# EAGLE design display adapter (EAGLE 9.0.1)
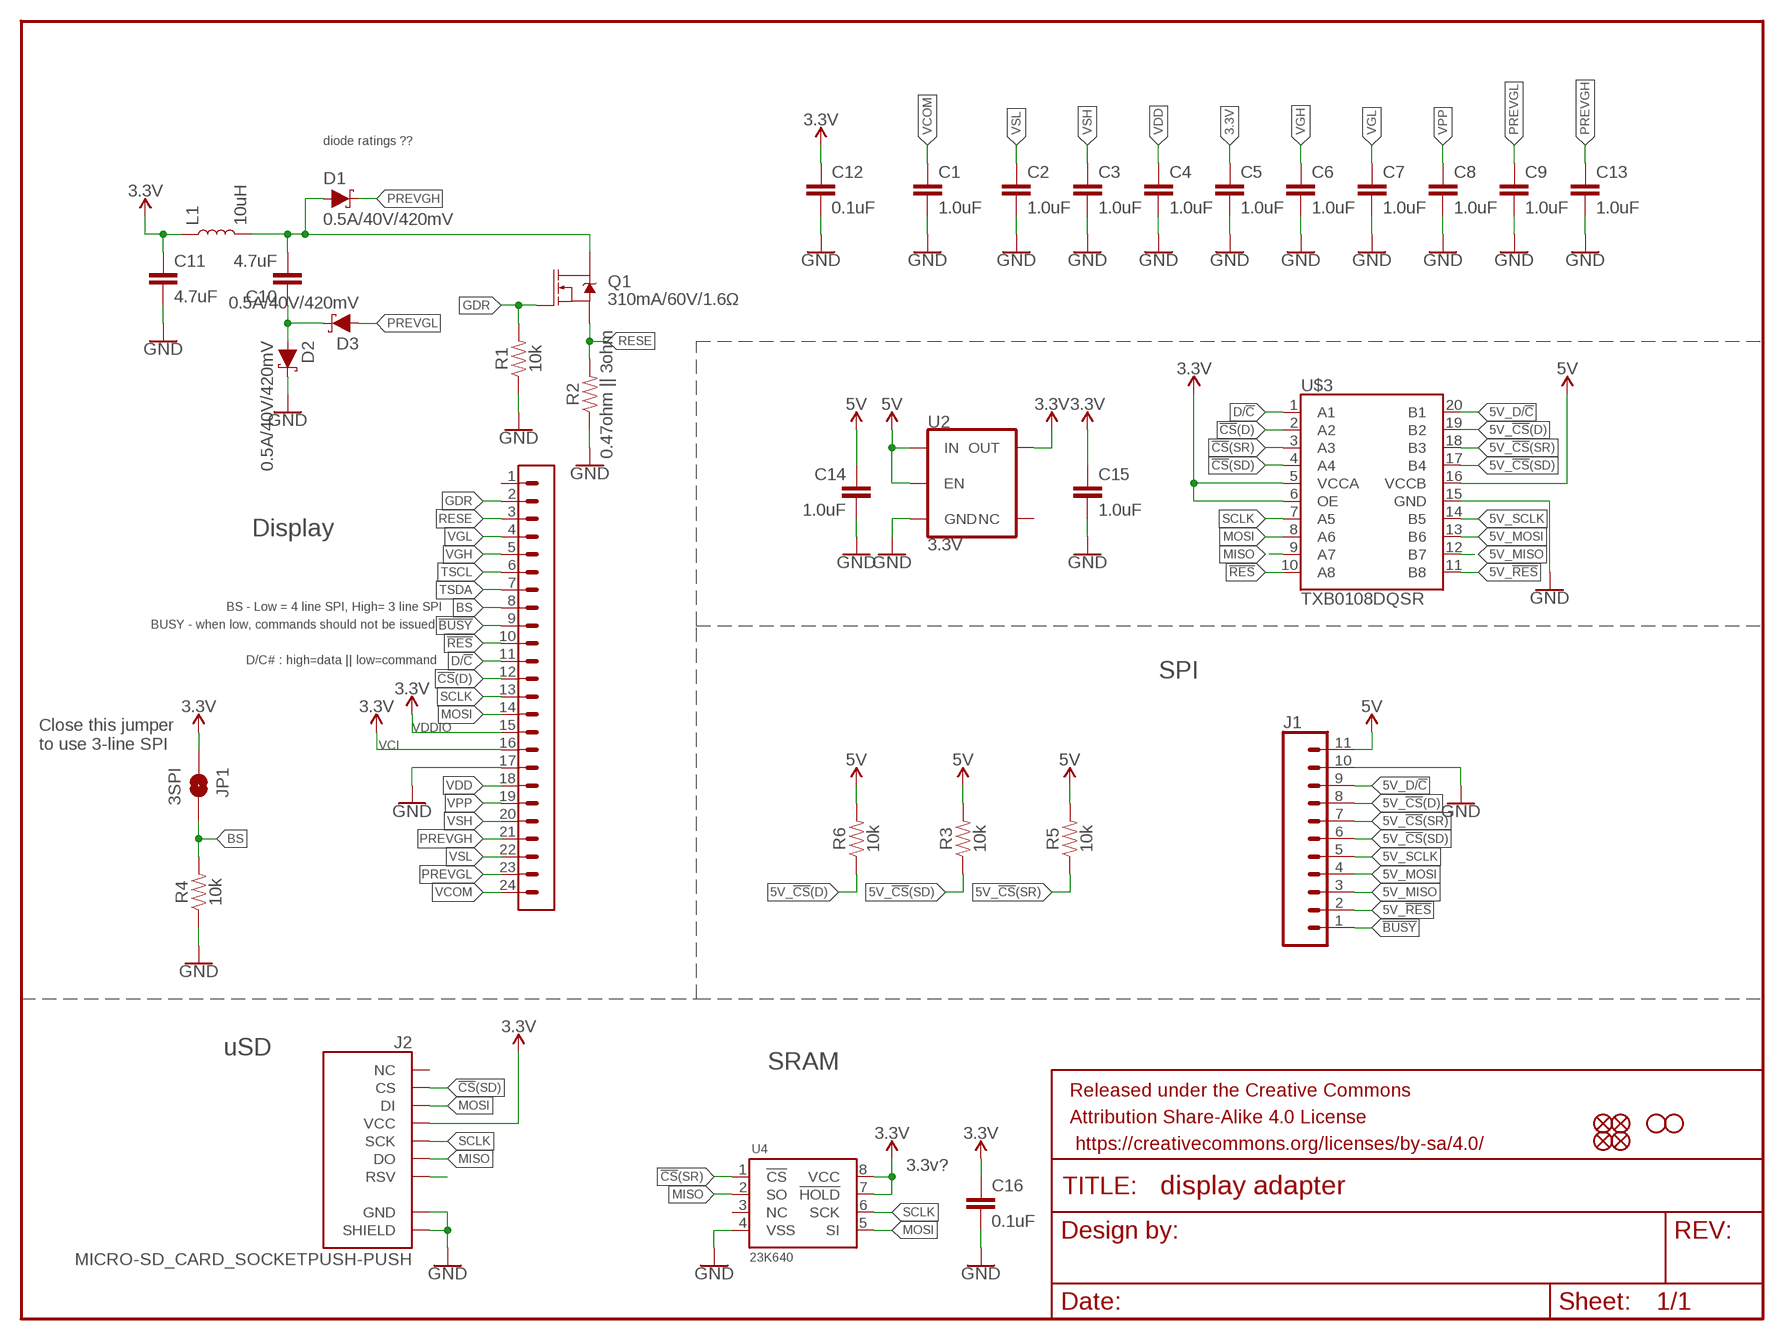
[diagram p0: schematic, sheet 1]

## Parts
C1  1.0uF  1.0UF-0603-16V-10%  [0603]
C2  1.0uF  1.0UF-0805-25V-10%  [0805]
C3  1.0uF  1.0UF-0805-25V-10%  [0805]
C4  1.0uF  1.0UF-0805-25V-10%  [0805]
C5  1.0uF  1.0UF-0805-25V-10%  [0805]
C6  1.0uF  1.0UF-0805-25V-10%  [0805]
C7  1.0uF  1.0UF-0805-25V-10%  [0805]
C8  1.0uF  1.0UF-0805-25V-10%  [0805]
C9  1.0uF  1.0UF-0805-25V-10%  [0805]
C10  4.7uF  22UF-0805-6.3V-20%  [0805]
C11  4.7uF  22UF-0805-6.3V-20%  [0805]
C12  0.1uF  0.1UF-0603-25V-(+80/-20%)  [0603]
C13  1.0uF  1.0UF-0805-25V-10%  [0805]
C14  1.0uF  1.0UF-0603-16V-10%  [0603]
C15  1.0uF  1.0UF-0603-16V-10%  [0603]
C16  0.1uF  0.1UF-0603-25V-(+80/-20%)  [0603]
D1  0.5A/40V/420mV  DIODE-SCHOTTKY-PMEG4005EJ  [SOD-323]
D2  0.5A/40V/420mV  DIODE-SCHOTTKY-PMEG4005EJ  [SOD-323]
D3  0.5A/40V/420mV  DIODE-SCHOTTKY-PMEG4005EJ  [SOD-323]
FD1  FIDUCIALUFIDUCIAL  [FIDUCIAL-MICRO]
FD2  FIDUCIALUFIDUCIAL  [FIDUCIAL-MICRO]
FD3  FIDUCIALUFIDUCIAL  [FIDUCIAL-MICRO]
FD4  FIDUCIALUFIDUCIAL  [FIDUCIAL-MICRO]
FRAME1  FRAME-LETTER  [CREATIVE_COMMONS]
H1  STAND-OFF  [STAND-OFF]
H2  STAND-OFF  [STAND-OFF]
J1  CONN_111X11_NO_SILK  [1X11_NO_SILK]
J2  MICRO-SD_CARD_SOCKETPUSH-PUSH  [MICRO-SD-SOCKET]
JP1  3SPI  JUMPER-SMT_2_NO_SILK  [SMT-JUMPER_2_NO_SILK]
L1  10uH  INDUCTOR-CDRH-10UH  [INDUCTOR_4.7UH]
Q1  310mA/60V/1.6Ω  MOSFET-NCH-2N7002PW  [SOT323]
R1  10k  10KOHM-0603-1/10W-1%  [0603]
R2  0.47ohm || 3ohm  RESISTOR0603  [0603]
R3  10k  10KOHM-0603-1/10W-1%  [0603]
R4  10k  10KOHM-0603-1/10W-1%  [0603]
R5  10k  10KOHM-0603-1/10W-1%  [0603]
R6  10k  10KOHM-0603-1/10W-1%  [0603]
U2  3.3V  V_REG_AP2112K-3.3V  [SOT23-5]
U4  23K640  [SO08]
U$1  24_PIN_FPC_0.5MM  [24_PIN_FPC_0.5MM]
U$3  TXB0108DQSR  TXB0108  [UFDFN-20]

## Nets
3.3V: C5.1 C11.1 C12.1 C15.1 C16.1 J2.VCC JP1.1 L1.P$1 U2.5(OUT) U4.7(!HOLD) U4.8(VCC) U$1.15 U$1.16 U$3.5(VCCA) U$3.6(OE)
5V: C14.1 J1.11 R3.2 R5.2 R6.2 U2.1(IN) U2.3(EN) U$3.16(VCCB)
5V_!CS!(D): J1.8 R6.1 U$3.19(B2)
5V_!CS!(SD): J1.6 R3.1 U$3.17(B4)
5V_!CS!(SR): J1.7 R5.1 U$3.18(B3)
5V_!RES: J1.2 U$3.11(B8)
5V_D/!C: J1.9 U$3.20(B1)
5V_MISO: J1.3 U$3.12(B7)
5V_MOSI: J1.4 U$3.13(B6)
5V_SCLK: J1.5 U$3.14(B5)
!BUSY: J1.1 U$1.9
!CS!(D): U$1.12 U$3.2(A2)
!CS!(SD): J2.CS U$3.4(A4)
!CS!(SR): U4.1(!CS) U$3.3(A3)
!RES: U$1.10 U$3.10(A8)
BS: JP1.2 R4.2 U$1.8
D/!C: U$1.11 U$3.1(A1)
GDR: Q1.1(G) R1.2 U$1.2
GND: C1.2 C2.2 C3.2 C4.2 C5.2 C6.2 C7.2 C8.2 C9.2 C11.2 C12.2 C13.2 C14.2 C15.2 C16.2 D2.C J1.10 J2.CD1(SHIELD) J2.GND R1.1 R2.1 R4.1 U2.2(GND) U4.4(VSS) U$1.17 U$3.15(GND)
MISO: J2.DO U4.2(SO) U$3.9(A7)
MOSI: J2.DI U4.5(SI) U$1.14 U$3.8(A6)
N$2: C10.1 D2.A D3.C
N$5: C10.2 D1.A L1.P$2 Q1.3(D)
N$11: J2.RSV1(RSV)
PREVGH: C13.1 D1.C U$1.21
PREVGL: C9.1 D3.A U$1.23
RESE: Q1.2(S) R2.2 U$1.3
SCLK: J2.SCLK(SCK) U4.6(SCK) U$1.13 U$3.7(A5)
TSCL: U$1.6
TSDA: U$1.7
VCOM: C1.1 U$1.24
VDD: C4.1 U$1.18
VGH: C6.1 U$1.5
VGL: C7.1 U$1.4
VPP: C8.1 U$1.19
VSH: C3.1 U$1.20
VSL: C2.1 U$1.22
Unconnected: J2.RSV2(NC) U2.4(NC) U4.3(NC) U$1.1

## Notes on the sheet
- diode ratings ??
- Display
- BS - Low = 4 line SPI, High= 3 line SPI
- BUSY - when low, commands should not be issued
- D/C# : high=data || low=command
- SPI
- VDDIO
- Close this jumper
  to use 3-line SPI
- VCI
- uSD
- SRAM
- 3.3v?

## Library data of the parts
C1 C14 C15 = SparkFun-Capacitors:1.0UF: 1µF ceramic capacitors A capacitor is a passive two-terminal electrical component used to store electrical energy temporarily in an electric field.; PROD_ID: CAP-00868
C2-C9 C13 = SparkFun-Capacitors:1.0UF: 1µF ceramic capacitors A capacitor is a passive two-terminal electrical component used to store electrical energy temporarily in an electric field.; PROD_ID: CAP-08064
C10 C11 = SparkFun-Capacitors:22UF: 22µF ceramic capacitors A capacitor is a passive two-terminal electrical component used to store electrical energy temporarily in an electric field.; PROD_ID: CAP-08402; VALUE: 22uF
C12 C16 = SparkFun-Capacitors:0.1UF: 0.1µF ceramic capacitors A capacitor is a passive two-terminal electrical component used to store electrical energy temporarily in an electric field.; PROD_ID: CAP-00810
D1-D3 = SparkFun-DiscreteSemi:DIODE-SCHOTTKY: Schottky diode A Schottky diode is a semiconductor diode which has a low forward voltage drop and a very fast switching action.; PROD_ID: DIO-10955
FD1-FD4 = SparkFun-Aesthetics:FIDUCIAL: Fiducial Alignment Points Point-of-reference for pick-and-place machines and other optical instruments.
FRAME1 = SparkFun-Aesthetics:FRAME-LETTER: Schematic Frame - Letter Standard 8.5x11 US Letter frame
H1 H2 = SparkFun-Hardware:STAND-OFF: Stand Off Drill holes for mechanically mounting via screws, standoffs, etc. Note: Use the keepout ring to avoid running the screw head into surrounding components. Variant Overviews STAND-OFF - Mechanical footprint for a #4 phillips button head screw. STAND-OFF-TIGHT - Mechanical footprint for a #4 phillips button head screw, Example SparkFun Products Screw - Phillips Head (1/4", 4-40, 10 pack) <https://www.sparkfun.com/products/10453> (PRT-10453) Screw - Phillips Head (1/2", 4-40, 10 pack) <https://www.sparkfun.com/products/10452> (PRT-10452) Screw - Phillips Head (3/4", 4-40, 10 pack) <https://www.sparkfun.com/products/10451> (PRT-10451) Screw - Phillips Head (1", 4-40, 10 pack) <https://www.sparkfun.com/products/10450> (PRT-10450)
J1 = SparkFun-Connectors:CONN_11: Multi connection point. Often used as Generic Header-pin footprint for 0.1 inch spaced/style header connections On any of the 0.1 inch spaced packages, you can populate with these: Break Away Headers - Straight <https://www.sparkfun.com/products/116> (PRT-00116) Break Away Male Headers - Right Angle <https://www.sparkfun.com/products/553> (PRT-00553) Female Headers <https://www.sparkfun.com/products/115> (PRT-00115) Break Away Headers - Machine Pin <https://www.sparkfun.com/products/117> (PRT-00117) Break Away Female Headers - Swiss Machine Pin <https://www.sparkfun.com/products/743> (PRT-00743) For SCREWTERMINALS and SPRING TERMINALS visit here: Screw Terimnals on SparkFun.com <https://www.sparkfun.com/search/results?term=Screw+Terminals> (5mm/3.5mm/2.54mm spacing) This device is also useful as a general connection point to wire up your design to another part of your project. Our various solder wires solder well into these plated through hole pads. Hook-Up Wire - Assortment (Stranded, 22 AWG) <https://www.sparkfun.com/products/11375> (PRT-11375) Hook-Up Wire - Assortment (Solid Core, 22 AWG) <https://www.sparkfun.com/products/11367> (PRT-11367) View the entire wire category on our website here <https://www.sparkfun.com/categories/141>
J2 = SparkFun-Connectors:MICRO-SD_CARD_SOCKET: microSD Socket for Transflash Push-push type µSD socket. tDoc lines correctly indicate media card edge positions when inserting (unlocked, locked, depressed). NOTE: CD1 and CD2 are connected internally, and the default detect state of the socket is detect pin to ground. SparkFun Products: WAV Trigger <https://www.sparkfun.com/products/13660> CAN-Bus Shield <https://www.sparkfun.com/products/13262> SparkFun Level Shifing microSD Breakout <https://www.sparkfun.com/products/13743>; PROD_ID: CONN-07820
JP1 = SparkFun-Jumpers:JUMPER-SMT_2_NO: Normally open jumper This jumper has two pads in close proximity to each other. Apply solder to close the connection. Round pads are easier to solder for beginners, but are a lot larger. SparkFun Product that uses the round pads: SparkFun EL Sequencer <https://www.sparkfun.com/products/12781>
L1 = SparkFun-Coils:INDUCTOR: Inductors Resist changes in electrical current. Basically a coil of wire. SparkFun Products: SparkFun Load Cell Amplifier - HX711 <https://www.sparkfun.com/products/13879> IOIO-OTG - V2.2 <https://www.sparkfun.com/products/13613>; PROD_ID: NDUC-13968
Q1 = SparkFun-DiscreteSemi:MOSFET-NCH: N-channel MOSFETs Voltage controlled devices that allow control of high current outputs. SparkFun Products: SparkFun OpenScale <https://www.sparkfun.com/products/13261> SparkFun Digital Sandbox <https://www.sparkfun.com/products/12651> SparkFun Monster Moto Shield <https://www.sparkfun.com/products/10182> SparkFun MOSFET Power Controller <https://www.sparkfun.com/products/11214>; PROD_ID: TRANS-11151
R1 R3-R6 = SparkFun-Resistors:10KOHM: 10kΩ resistor A resistor is a passive two-terminal electrical component that implements electrical resistance as a circuit element. Resistors act to reduce current flow, and, at the same time, act to lower voltage levels within circuits. - Wikipedia; PROD_ID: RES-00824
R2 = SparkFun-Resistors:RESISTOR: Generic Resistor Package
U2 = SparkFun-IC-Power:V_REG_AP2112: AP2112 - 600mA CMOS LDO Regulator w/ Enable The AP2112 is CMOS process low dropout linear regulator with enable function, the regulator delivers a guaranteed 600mA (min.) continuous load current. Features Output Voltage Accuracy: ±1.5% Output Current: 600mA (Min.) Foldback Short Current Protection: 50mA Enable Function to Turn ON/OFF VOUT Low Dropout Voltage (3.3V): 250mV (Typ.) @IOUT=600mA Excellent Load Regulation: 0.2%/A (Typ.) Excellent Line Regulation: 0.02%/V (Typ.) Low Quiescent Current: 55μA (Typ.) Low Standby Current: 0.01μA (Typ.) Low Output Noise: 50μVRMS PSRR: 100Hz -65dB, 1kHz -65dB OTSD Protection Stable with 1.0μF Flexible Cap: Ceramic, Tantalum and Aluminum Electrolytic Operation Temperature Range: -40°C to 85°C ESD: MM 400V, HBM 4000V; PROD_ID: VREG-12457
U4 = SparkFun-IC-Memory:23K640
U$1 = ePaper:24_PIN_FPC_0.5MM
U$3 = SparkFun-IC-Comms:TXB0108: 8-Bit Bi-Directional Level Shifter 1.2V-3.6V (VCCA) to 1.65V-5.5V (VCCB) bi-directional level shifter with auto direction sensing. Max data rate - VCCA 1.2V: 20Mbps (50ns), VCCA 3.3V: 100Mbps (10ns) Digikey: 296-27217-1-ND (20-UFDFN) SparkFun Products SparkFun GPS Logger Shield <https://www.sparkfun.com/products/13750> (GPS-13750) SparkFun Block for Intel® Edison - microSD <https://www.sparkfun.com/products/13041> (DEV-13041) SparkFun Block for Intel® Edison - Dual H-Bridge <https://www.sparkfun.com/products/13043> (DEV-13043) SparkFun Block for Intel® Edison - GPIO <https://www.sparkfun.com/products/13038> (DEV-13038) SparkFun Block for Intel® Edison - Raspberry Pi B <https://www.sparkfun.com/products/13044> (DEV-13044); PROD_ID: IC-12292

## Board
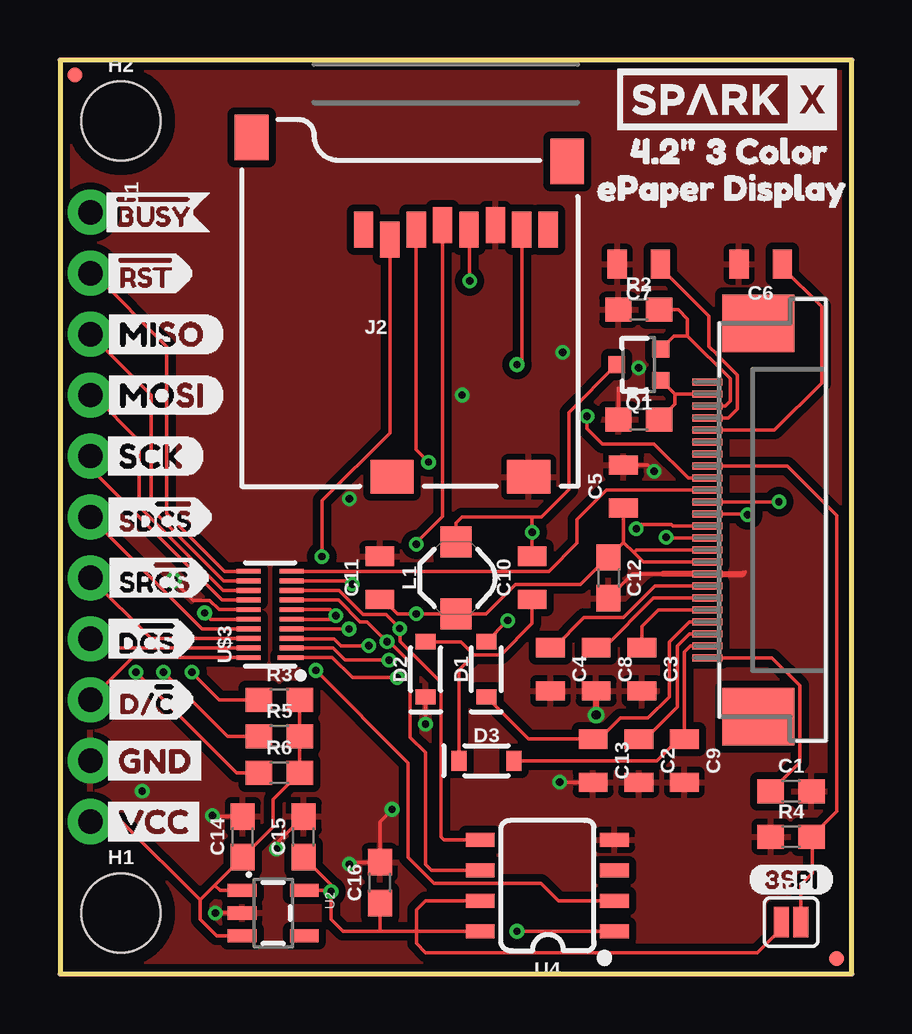
[diagram p1: board, top side]
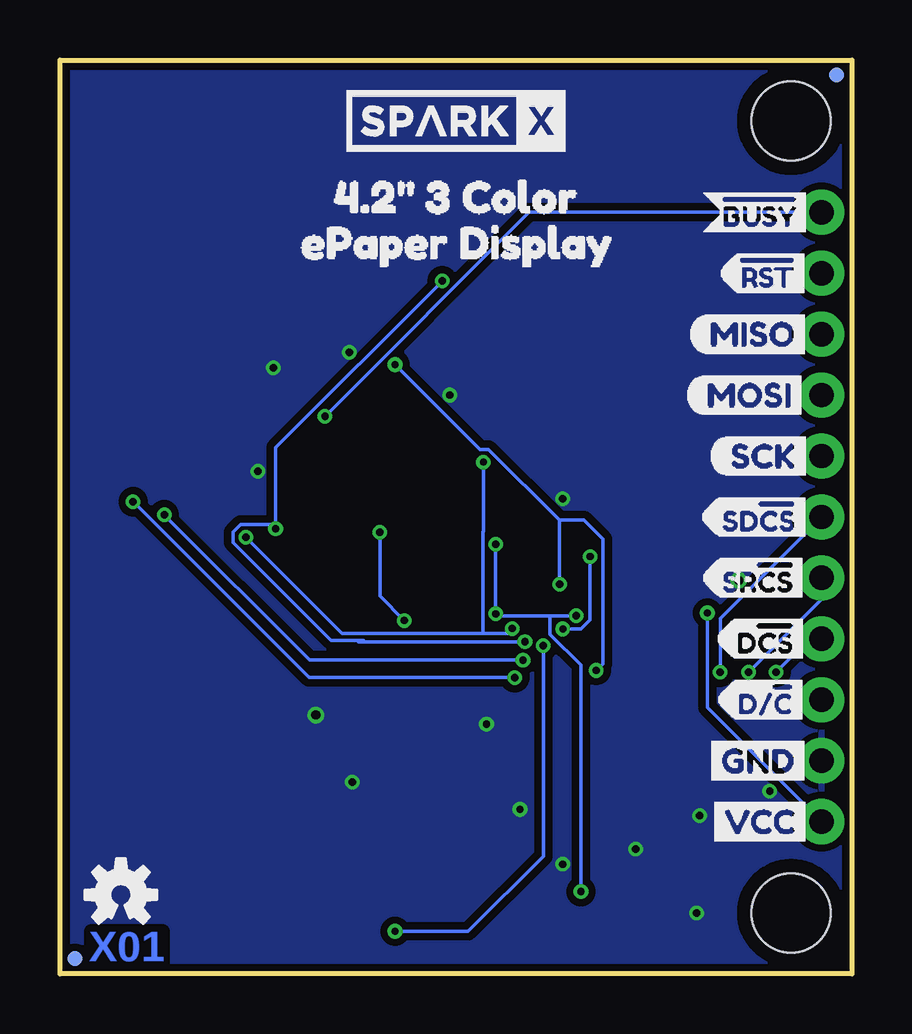
[diagram p2: board, bottom side, seen from below]

Size 33.02 x 38.1 mm. Coordinates in mm from the lower left corner, seen from the top.
Outline: 0,0 33.02,0 33.02,38.1 0,38.1 0,0
Copper layers (1*16): Top 0.035mm / dielectric 1.5mm / Bottom 0.035mm
Design rules "SparkFun-2-layer-PCBWay-LIMIT": minimum track width 6mil, minimum drill 0.3mm, track to track 6mil, track to pad 6mil, pad to pad 6mil, via to via 6mil, smd to smd 6mil, copper to edge 6mil, drill to drill 6mil, minimum pad ring 6mil, minimum via ring 6mil, stop-mask expansion 4mil, vias tented up to drill 25mil, thermal gap 10mil

### Footprints (pad centres in the part's own frame; a part is rotated, then mirrored left to right if it is on the bottom)
0603 = smd 1.1 x 1: 1 -0.85,0; 2 0.85,0
0805 = smd 0.8 x 1.2: 1 -0.9,0; 2 0.9,0
SOD-323 = smd 0.63 x 0.83: A 1.15,0; C -1.15,0
FIDUCIAL-MICRO = smd 0.635 x 0.635: 1 0,0
STAND-OFF = hole 3.302: 0,0
1X11_NO_SILK = drill 1.016 pad 1.88: 1 0,0; 2 2.54,0; 3 5.08,0; 4 7.62,0; 5 10.16,0; 6 12.7,0; 7 15.24,0; 8 17.78,0; 9 20.32,0; 10 22.86,0; 11 25.4,0
MICRO-SD-SOCKET = smd 1.8 x 1.4: CD1 -2.05,0.4; CD2 -7.75,0.4 | smd 0.8 x 1.5: CS -7.84,10.3; DI -6.74,10.7; DO -2.34,10.7; GND -3.44,10.9; RSV1 -8.94,10.7; RSV2 -1.24,10.7; SCLK -4.54,10.7; VCC -5.64,10.9 | smd 1.4 x 1.9: GND1 -13.6,14.55; GND3 -0.45,13.55
SMT-JUMPER_2_NO_SILK = smd 0.635 x 1.27: 1 -0.406,0; 2 0.406,0
INDUCTOR_4.7UH = smd 1.3 x 1.3: P$1 -1.5,0; P$2 1.5,0
SOT323 = smd 0.7 x 0.7: 1 -0.65,-0.925; 2 0.65,-0.925; 3 0,0.925
SOT23-5 = smd 0.55 x 1.2: 1 -0.95,-1.3; 2 0,-1.3; 3 0.95,-1.3; 4 0.95,1.3; 5 -0.95,1.3
SO08 = smd 0.6 x 1.2: 1 -1.905,-2.8; 2 -0.635,-2.8; 3 0.635,-2.8; 4 1.905,-2.8; 5 1.905,2.8; 6 0.635,2.8; 7 -0.635,2.8; 8 -1.905,2.8
24_PIN_FPC_0.5MM = smd 0.3 x 1.25: 1 5.75,2.225; 2 5.25,2.225; 3 4.75,2.225; 4 4.25,2.225; 5 3.75,2.225; 6 3.25,2.225; 7 2.75,2.225; 8 2.25,2.225; 9 1.75,2.225; 10 1.25,2.225; 11 0.75,2.225; 12 0.25,2.225; 13 -0.25,2.225; 14 -0.75,2.225; 15 -1.25,2.225; 16 -1.75,2.225; 17 -2.25,2.225; 18 -2.75,2.225; 19 -3.25,2.225; 20 -3.75,2.225; 21 -4.25,2.225; 22 -4.75,2.225; 23 -5.25,2.225; 24 -5.75,2.225 | smd 2.4 x 3: NC1 8.2,0.1; NC2 -8.2,0.1
UFDFN-20 = smd 0.2 x 1.1: 1 -1.8,-0.85 | smd 0.2 x 1: 2 -1.4,-0.9; 3 -1,-0.9; 4 -0.6,-0.9; 5 -0.2,-0.9; 6 0.2,-0.9; 7 0.6,-0.9; 8 1,-0.9; 9 1.4,-0.9; 10 1.8,-0.9; 11 1.8,0.9; 12 1.4,0.9; 13 1,0.9; 14 0.6,0.9; 15 0.2,0.9; 16 -0.2,0.9; 17 -0.6,0.9; 18 -1,0.9; 19 -1.4,0.9; 20 -1.8,0.9

### Placement (x,y rotation side)
C1  30.48,7.62 0 top
C2  24.13,8.89 270 top
C3  24.26,12.7 270 top
C4  20.45,12.7 270 top
C5  23.5,20.32 90 top
C6  29.21,29.59 180 top
C7  24.13,29.59 180 top
C8  22.35,12.7 270 top
C9  26.04,8.89 270 top
C10  19.68,16.51 90 top
C11  13.34,16.51 90 top
C12  22.86,16.51 270 top
C13  22.23,8.89 270 top
C14  7.62,5.71 90 top
C15  10.16,5.71 90 top
C16  13.34,3.81 90 top
D1  17.78,12.7 90 top
D2  15.24,12.7 90 top
D3  17.78,8.89 0 top
FD1  0.64,37.47 0 bottom
FD2  32.38,0.64 0 bottom
FD3  32.38,0.64 0 top
FD4  0.64,37.47 0 top
FRAME1  2.54,-10.16 0 top  (outside the outline)
H1  2.54,2.54 0 top
H2  2.54,35.56 0 top
J1  1.27,31.75 270 top
J2  21.59,20.32 0 top
JP1  30.48,2.16 0 top
L1  16.51,16.51 90 top
Q1  24.13,25.4 90 top
R1  24.13,23.11 0 top
R2  24.13,27.69 0 top
R3  9.14,11.43 0 top
R4  30.48,5.71 0 top
R5  9.14,9.91 0 top
R6  9.14,8.38 0 top
U2  8.89,2.54 270 top
U4  20.32,3.68 90 top
U$1  29.21,18.92 90 top
U$2  [OSHW-LOGO-S]  30.48,3.3 0 bottom
U$3  8.76,14.99 90 top
U$4  [#BUSY0]  1.27,31.75 0 top
U$5  SPARKX-LOGO4  [SPARKX-MEDIUM]  27.81,36.45 0 top
U$6  [#BUSY1]  6.48,31.75 0 bottom
U$7  [D##C10]  1.4,11.43 0 top
U$8  [MISO1]  1.52,26.67 0 top
U$9  [D#CS2]  1.4,13.97 0 top
U$10  [SD#CS0]  1.4,19.05 0 top
U$11  [#RST1]  1.4,29.21 0 top
U$12  [3SPI0]  28.7,3.94 0 top
U$13  [VCC9]  1.52,6.35 0 top
U$14  [GND9]  1.52,8.89 0 top
U$15  [SR#CS1]  1.4,16.51 0 top
U$16  [MOSI0]  1.52,24.13 0 top
U$17  [SCK2]  1.52,21.59 0 top
U$18  SPARKX-LOGO4  [SPARKX-MEDIUM]  16.51,35.56 0 bottom
U$19  [3_COLOR2]  18.92,32.38 0 bottom
U$20  [#RST2]  5.71,29.21 0 bottom
U$21  [VCC9]  6.22,6.35 0 bottom
U$22  [3_COLOR3]  26.04,34.29 0 top
U$23  [4#2#0]  22.86,34.29 0 top
U$24  [MISO3]  6.86,26.67 0 bottom
U$25  [MOSI4]  6.99,24.13 0 bottom
U$26  [SCK5]  5.97,21.59 0 bottom
U$27  [SD#CS6]  6.48,19.05 0 bottom
U$28  [SR#CS7]  6.48,16.51 0 bottom
U$29  [D#CS8]  5.84,13.97 0 bottom
U$30  [D##C9]  5.84,11.43 0 bottom
U$31  [GND11]  6.35,8.89 0 bottom
U$32  [EPAPER_DISPLAY5]  24.13,30.48 0 bottom
U$33  [EPAPER_DISPLAY4]  21.46,32.77 0 top
U$34  [4#2#1]  22.73,32.38 0 bottom

### Tracks (layer width: path | path; a pad name or v marks a point on that pad's centre or on a via)
3.3V  (via drill 0.3)
  Top 0.152: C12.1 22.88,17.38 | 22.88,17.38 23.5,18 | 23.5,18 C5.1 | U$1.16 24.32,17.17 23.92,17.57 | 23.92,17.57 23.5,18 | U$1.15 24.02,17.67 23.92,17.57 | C11.1 13.47,15.61 14.07,15.01 v14.86,15.01 L1.P$1 17.76,15.01 18.99,16.24 21.7,16.24 22.84,17.38 22.88,17.38 | U4.7 15.24,3.05 14.86,2.67 14.86,1.78 | C15.1 11.3,3.72 v11.3,3.43 | v11.3,3.43 11.3,2.29 11.81,1.78 13.34,1.78 | U2.5 11.24,3.49 v11.3,3.43 | U4.8 14.86,1.78 | 14.86,1.78 14.86,1.27 15.24,0.89 29.08,0.89 29.84,1.65 29.84,1.93 JP1.1 | U$3.5 11.36,14.79 v11.5,14.93 11.25,15.19 U$3.6 | J2.VCC 15.95,19.07 14.86,17.98 v14.86,17.91 | 14.86,1.78 13.34,1.78 | C16.1 13.34,1.78
  Bottom 0.152: v11.3,3.43 11.3,12.88 12.59,14.16 12.59,14.93 | v14.86,17.91 v14.86,15.01 14.78,14.93 12.59,14.93 | v11.5,14.93 12.59,14.93
5V  (via drill 0.3)
  Top 0.152: R3.2 R5.2 R6.2 8.89,7.28 8.89,6.13 C14.1 | C14.1 7.59,4.83 | U2.3 6.54,1.59 5.84,2.29 5.84,3.09 | C14.1 6.46,3.7 | 6.46,3.7 5.84,3.09 | U2.1 6.67,3.49 6.46,3.7 | J1.11 2.58,6.35 5.84,3.09 | U$3.16 6.29,14.79 v6.03,15.05
  Bottom 0.152: v6.03,15.05 6.03,11.11 J1.11
5V_!CS!(D)  (via drill 0.3)
  Top 0.152: U$3.19 1.65,13.59 J1.8 | R6.1 7.37,8.38 v3.17,12.58
  Bottom 0.152: v3.17,12.58 1.78,13.97 J1.8
5V_!CS!(SD)  (via drill 0.3)
  Top 0.152: U$3.17 5.93,14.39 J1.6 | R3.1 6.64,11.43 v5.5,12.57
  Bottom 0.152: 4.74,15.58 J1.6 5.5,14.82 v5.5,12.57
5V_!CS!(SR)  (via drill 0.3)
  Top 0.152: U$3.18 3.79,13.99 J1.7 | R5.1 6.99,9.91 v4.32,12.57
  Bottom 0.152: J1.7 1.27,15.62 1.75,15.14 2.44,14.45 v4.32,12.57
5V_!RES
  Top 0.152: U$3.11 6.86,16.79 4.45,19.2 4.45,26.16 1.4,29.21 J1.2
5V_D/!C
  Top 0.152: U$3.20 3.03,13.19 J1.9
5V_MISO
  Top 0.152: U$3.12 6.83,16.39 3.81,19.4 3.81,24.13 J1.3
5V_MOSI
  Top 0.152: U$3.13 6.8,15.99 3.3,19.48 3.3,22.23 1.4,24.13 J1.4
5V_SCLK
  Top 0.152: U$3.14 6.77,15.59 1.27,21.08 J1.5
!BUSY  (via drill 0.3)
  Top 0.152: U$1.9 26.19,20.67 24.77,22.1 22.61,22.1 21.97,22.73 v21.97,23.24
  Bottom 0.152: v21.97,23.24 13.46,31.75 J1.1
!CS!(D)  (via drill 0.3)
  Top 0.152: U$1.12 28.64,19.17 v28.67,19.14 | U$3.2 11.38,13.59 11.88,13.09 v13.72,13.09
  Bottom 0.152: v28.67,19.14 22.62,13.09 v13.72,13.09
!CS!(SD)  (via drill 0.3)
  Top 0.152: U$3.4 v12.05,14.39 v12.05,14.38 | J2.CS 13.75,22.55 10.92,19.73 v10.92,17.4
  Bottom 0.152: v12.05,14.38 11.3,14.38 10.92,14.76 v10.92,17.4
!CS!(SR)  (via drill 0.3)
  Top 0.152: 22.38,1.78 U4.1 v19.05,1.78 | U$3.3 9.68,13.97 11.43,13.97 11.72,13.68 v12.87,13.68
  Bottom 0.152: v12.87,13.68 12.87,4.91 16,1.78 v19.05,1.78
!RES
  Top 0.152: U$1.10 22.78,20.17 21.56,18.95 21.56,17.96 20.38,16.78 9.7,16.78 9.69,16.76 U$3.10
BS
  Top 0.152: JP1.2 30.89,3.71 31.37,4.19 31.37,5.68 R4.2 32.38,6.77 32.38,19.11 30.32,21.17 U$1.8
D/!C  (via drill 0.3)
  Top 0.152: U$1.11 v29.96,19.67 v29.97,19.68 | U$3.1 11.35,13.19 12.19,12.35 v14.06,12.35
  Bottom 0.152: v29.97,19.68 22.64,12.35 v14.06,12.35
GDR
  Top 0.152: Q1.1 25.63,24.17 | 25.63,24.17 U$1.2 | R1.2 25.63,23.77 25.63,24.17
GND  (via drill 0.3, 0.38)
  Top 0.152: U2.2 v6.48,2.54 | C12.2 23.87,16.67 25.15,16.67 | 28.48,16.67 28.57,16.76 | U$3.15 6.64,15.19 6.25,15.58 5.55,15.58 v4.72,16.41 | C15.2 9.02,5.42 v9.02,5.21 | D2.C v15.24,10.41 | C14.2 6.39,6.57 v6.35,6.6 | C13.2 v20.84,7.99 v20.83,8 | C5.2 24.5,21.22 v24.77,20.95 | R1.1 23.28,24.42 | v13.84,6.86 13.34,6.35 C16.2 12.15,4.66 v12.06,4.57
  Top 0.254: 25.15,16.67 U$1.17 28.48,16.67 | C8.2 v22.35,10.79
  other vias: 24.13,25.27 12.06,19.81 16.76,24.13 20.95,25.91 3.43,7.62
  pour Top (isolate 0.305): 33.02,38.1 33.02,0 0,0 0,38.1
  pour Bottom (isolate 0.305): 33.02,38.1 33.02,0 0,0 0,38.1
MISO  (via drill 0.3)
  Top 0.152: U$3.9 12.05,16.39 v12.19,16.25 | v19.05,25.4 19.25,25.6 J2.DO | U4.2 20.78,3.05 20.04,3.79 15.6,3.79 14.52,4.86 14.52,8.8 v10.67,12.65
  Bottom 0.152: v19.05,25.4 15.52,21.87 15.15,21.87 12.19,18.91 | v12.19,16.25 12.19,18.91 | 12.19,18.91 11.18,18.91 10.39,18.13 10.39,12.93 v10.67,12.65
MOSI  (via drill 0.3)
  Top 0.152: U$3.8 11.64,15.99 12.64,14.98 13.59,14.98 v14.17,14.41 | U4.5 16,5.59 15.88,5.71 15.88,12.15 14.17,13.87 v14.17,14.41 | v14.16,14.4 | v14.16,14.4 v14.17,14.41 | U$1.14 25.31,18.17 v25.27,18.21 | J2.DI 14.85,21.85 v15.37,21.34
  Bottom 0.152: v25.27,18.21 21.27,14.2 15.39,14.2 | v14.16,14.4 14.36,14.2 15.39,14.2 | v15.37,21.34 15.37,18.44 15.39,18.44 15.39,14.2
N$2
  Top 0.152: D2.A 16.73,13.85 17.27,13.31 | 17.27,13.31 18.39,13.31 19.68,14.61 C10.1 | D3.C 16.63,12.67 17.27,13.31
N$5  (via drill 0.3)
  Top 0.152: C10.2 v19.68,18.41 19.68,19.05 | L1.P$2 16.51,18.8 16.76,19.05 19.68,19.05 | 19.68,19.05 20.07,19.05 21.21,20.19 21.21,23.4 Q1.3 | D1.A v18.66,14.73 v18.67,14.73
  Bottom 0.152: v18.67,14.73 19.68,15.75 v19.68,18.41
PREVGH
  Top 0.152: U$1.21 26.23,14.67 25.4,13.84 25.4,11.56 24.51,10.67 23.37,10.67 22.49,9.79 C13.1 19.54,9.79 D1.C
PREVGL
  Top 0.152: U$1.23 26.29,13.67 26.04,13.42 C9.1 25.79,9.79 24.89,8.89 D3.A
RESE
  Top 0.152: U$1.3 27.74,23.67 27.94,23.88 27.94,24.82 26.16,26.59 | R2.2 25.78,27.69 26.16,27.3 26.16,26.59 | Q1.2 25.6,26.59 26.16,26.59
SCLK  (via drill 0.3)
  Top 0.152: U$3.7 11.61,15.59 12.51,14.68 12.8,14.68 v13.63,13.85 13.73,13.85 14.6,12.98 14.6,9.87 15.24,9.23 15.24,4.57 15.49,4.32 U4.6 | U$1.13 25.56,18.67 25.49,18.74 24.2,18.74 v24.03,18.56 | v17.08,28.89 17.08,30.99 J2.SCLK
  Bottom 0.152: v13.63,13.85 20.32,13.85 | 20.32,13.85 20.58,13.85 | 20.32,13.85 20.37,13.89 21.71,13.89 25.81,17.98 25.81,18.43 25.49,18.74 24.2,18.74 v24.03,18.56 24.03,21.94 v17.08,28.89
VCOM
  Top 0.152: U$1.24 29.68,13.17 30.84,12.02 30.84,8.83 C1.1
VDD
  Top 0.152: C4.1 20.59,13.6 21.84,14.86 23.5,14.86 24.81,16.17 U$1.18
VGH
  Top 0.152: C6.1 30.11,29.45 31.75,27.81 31.75,24.64 29.79,22.67 U$1.5
VGL
  Top 0.152: U$1.4 27.87,23.17 28.25,23.55 28.25,24.96 27.38,25.83 27.05,26.16 27.05,27.43 25.03,29.45 C7.1
VPP
  Top 0.152: U$1.19 24.74,15.67 22.67,13.6 C8.1
VSH
  Top 0.152: C3.1 24.26,14.48 24.95,15.17 U$1.20
VSL
  Top 0.152: U$1.22 26.24,14.17 25.73,13.66 25.73,11.12 24.64,10.03 24.37,10.03 C2.1

### Text on the board
Bottom: X01
tDocu: Ciara Jekel